# Altium schematic sheet TopSCH.SchDoc: Схема соединения
size 420 x 297 mm; ApprovedBy: Мешков; CheckedBy: Черноскутов; Author: Самойлов; CompanyName: РГППУ; Title2str: основных блоков; DecimalNumber: АБВГ.123456.001 33
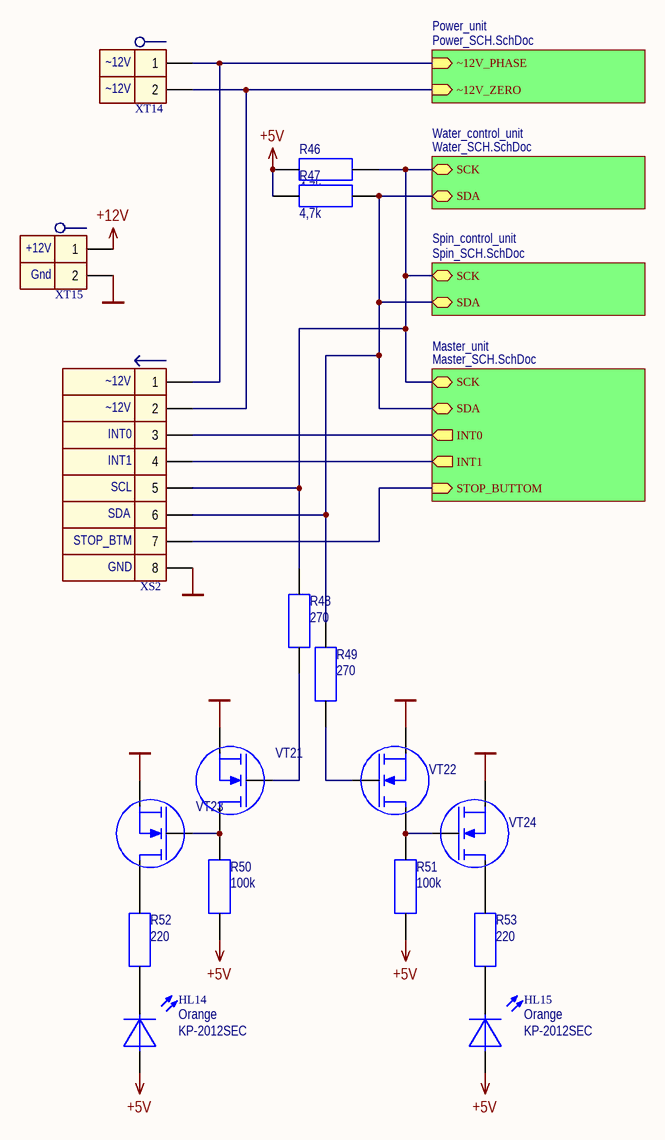
[diagram p0: TopSCH.SchDoc]

## Parts
HL14  Orange  ManufacturerPartNumber: KP-2012SEC  [DIOMELF2012M]
HL15  Orange  ManufacturerPartNumber: KP-2012SEC  [DIOMELF2012M]
R46  4,7k  [SMDRC0805]
R47  4,7k  [SMDRC0805]
R48  270  [SMDRC0805]
R49  270  [SMDRC0805]
R50  100k  [SMDRC0805]
R51  100k  [SMDRC0805]
R52  220  [SMDRC0805]
R53  220  [SMDRC0805]
VT21  2N7002  [SOT23 (TO-236AB)]  (value not drawn)
VT22  2N7002  [SOT23 (TO-236AB)]  (value not drawn)
VT23  2N7002  [SOT23 (TO-236AB)]  (value not drawn)
VT24  2N7002  [SOT23 (TO-236AB)]  (value not drawn)
XS2  PLS-08R  [PLS-08R1]  (value not drawn)
XT14  330-021-12  [330-021-12]  (value not drawn)
XT15  330-021-12  [330-021-12]  (value not drawn)

## Sub-sheets
Master_unit = Master_SCH.SchDoc: SCK (bidir), SDA (bidir), STOP_BUTTOM (in), INT0 (out), INT1 (out)
Power_unit = Power_SCH.SchDoc: ~12V_PHASE (in), ~12V_ZERO (in)
Spin_control_unit = Spin_SCH.SchDoc: SCK (bidir), SDA (bidir)
Water_control_unit = Water_SCH.SchDoc: SCK (bidir), SDA (bidir)

## Nets
+5V: HL14.1 HL15.1 R46.2 R47.2 R50.2 R51.2
+12V: XT15.1
GND: VT21.2(S) VT22.2(S) VT23.2(S) VT24.2(S) XS2.8 XT15.2
NetHL14_2: HL14.2 R52.2
NetHL15_2: HL15.2 R53.2
NetR46_1: R46.1 R48.2 XS2.5 ; sheet Water_control_unit/SCK, sheet Spin_control_unit/SCK, sheet Master_unit/SCK
NetR47_1: R47.1 R49.2 XS2.6 ; sheet Water_control_unit/SDA, sheet Spin_control_unit/SDA, sheet Master_unit/SDA
NetR48_1: R48.1 VT21.1(G)
NetR49_1: R49.1 VT22.1(G)
NetR50_1: R50.1 VT21.3(D) VT23.1(G)
NetR51_1: R51.1 VT22.3(D) VT24.1(G)
NetR52_1: R52.1 VT23.3(D)
NetR53_1: R53.1 VT24.3(D)
NetXS2_1: XS2.1 XT14.1 ; sheet Power_unit/~12V_PHASE
NetXS2_2: XS2.2 XT14.2 ; sheet Power_unit/~12V_ZERO
NetXS2_3: XS2.3 ; sheet Master_unit/INT0
NetXS2_4: XS2.4 ; sheet Master_unit/INT1
NetXS2_7: XS2.7 ; sheet Master_unit/STOP_BUTTOM

## Notes on the sheet
- (near XT14) ~12V
- (near XT15) +12V
- (near XT15) Gnd
- (near XS2) ~12V
- (near XS2) INT0
- (near XS2) INT1
- (near XS2) SDA
- (near XS2) SCL
- (near XS2) STOP_BTM
- (near XS2) GND
- Изм.
- Лист
- N*докум.
- Подп.
- Дата
- Лит.
- Масса
- Масштаб
- Разраб.
- Пров.
- Т.контр.
- Лиcт
- Лиcтов
- Н.контр.
- Утв.

## Library data of the parts
HL14 HL15 = LED1_O: Diod LED SMD Orange; ComponentLink1Description: Datasheet; Cost: 4,91; ComponentLink2Description: Datasheet-local; ComponentLink2URL: *; Color: Orange
R46 R47 = Resistor 0805 4,7k: Generic resistor; PartNumber: Resistor 0805 4,7k; Value: 4,7k; ComponentLink1URL: http://www.mouser.com/ds/2/447/PYu-RC0402_51_RoHS_L_6_r-8721.pdf; ComponentLink1Description: Datasheet; Package: 0805
R48 R49 = Resistor 0805 270: Generic resistor; PartNumber: Resistor 0805 270; Value: 270; ComponentLink1URL: http://www.mouser.com/ds/2/447/PYu-RC0402_51_RoHS_L_6_r-8721.pdf; ComponentLink1Description: Datasheet; Package: 0805
R50 R51 = Resistor 0805 100k: Generic resistor; PartNumber: Resistor 0805 100k; Value: 100k; ComponentLink1URL: http://www.mouser.com/ds/2/447/PYu-RC0402_51_RoHS_L_6_r-8721.pdf; ComponentLink1Description: Datasheet; Package: 0805
R52 R53 = Resistor 0805 220: Generic resistor; PartNumber: Resistor 0805 220; Value: 220; ComponentLink1URL: http://www.mouser.com/ds/2/447/PYu-RC0402_51_RoHS_L_6_r-8721.pdf; ComponentLink1Description: Datasheet; Package: 0805
VT21-VT24 = 2N7002 n-MOSFET: 60V, 300mA N-channel Trench MOSFET; ManufacturerPartNumber: 2N7002
XS2 = Con8_M PLS-08MR: Male 8-pin connection; ManufacturerPartNumber: PLS-08R; ComponentLink1Description: Datasheet; ComponentLink1URL: http://www.promelec.ru/catalog/406/1218/1223/1/99528/; ComponentLink2Description: Datasheet-local; ComponentLink2URL: *
XT14 XT15 = Con2_D 330-021-12: Demountable connection  2-pin; Manufacturer: Degson Electronics Co., Ltd; ManufacturerPartNumber: 330-021-12; ComponentLink1Description: Datasheet; Cost: 7,45; Supplier: Промэлектроника; ComponentLink2Description: Datasheet-local